# EAGLE design LightLab (EAGLE 7.6.0)
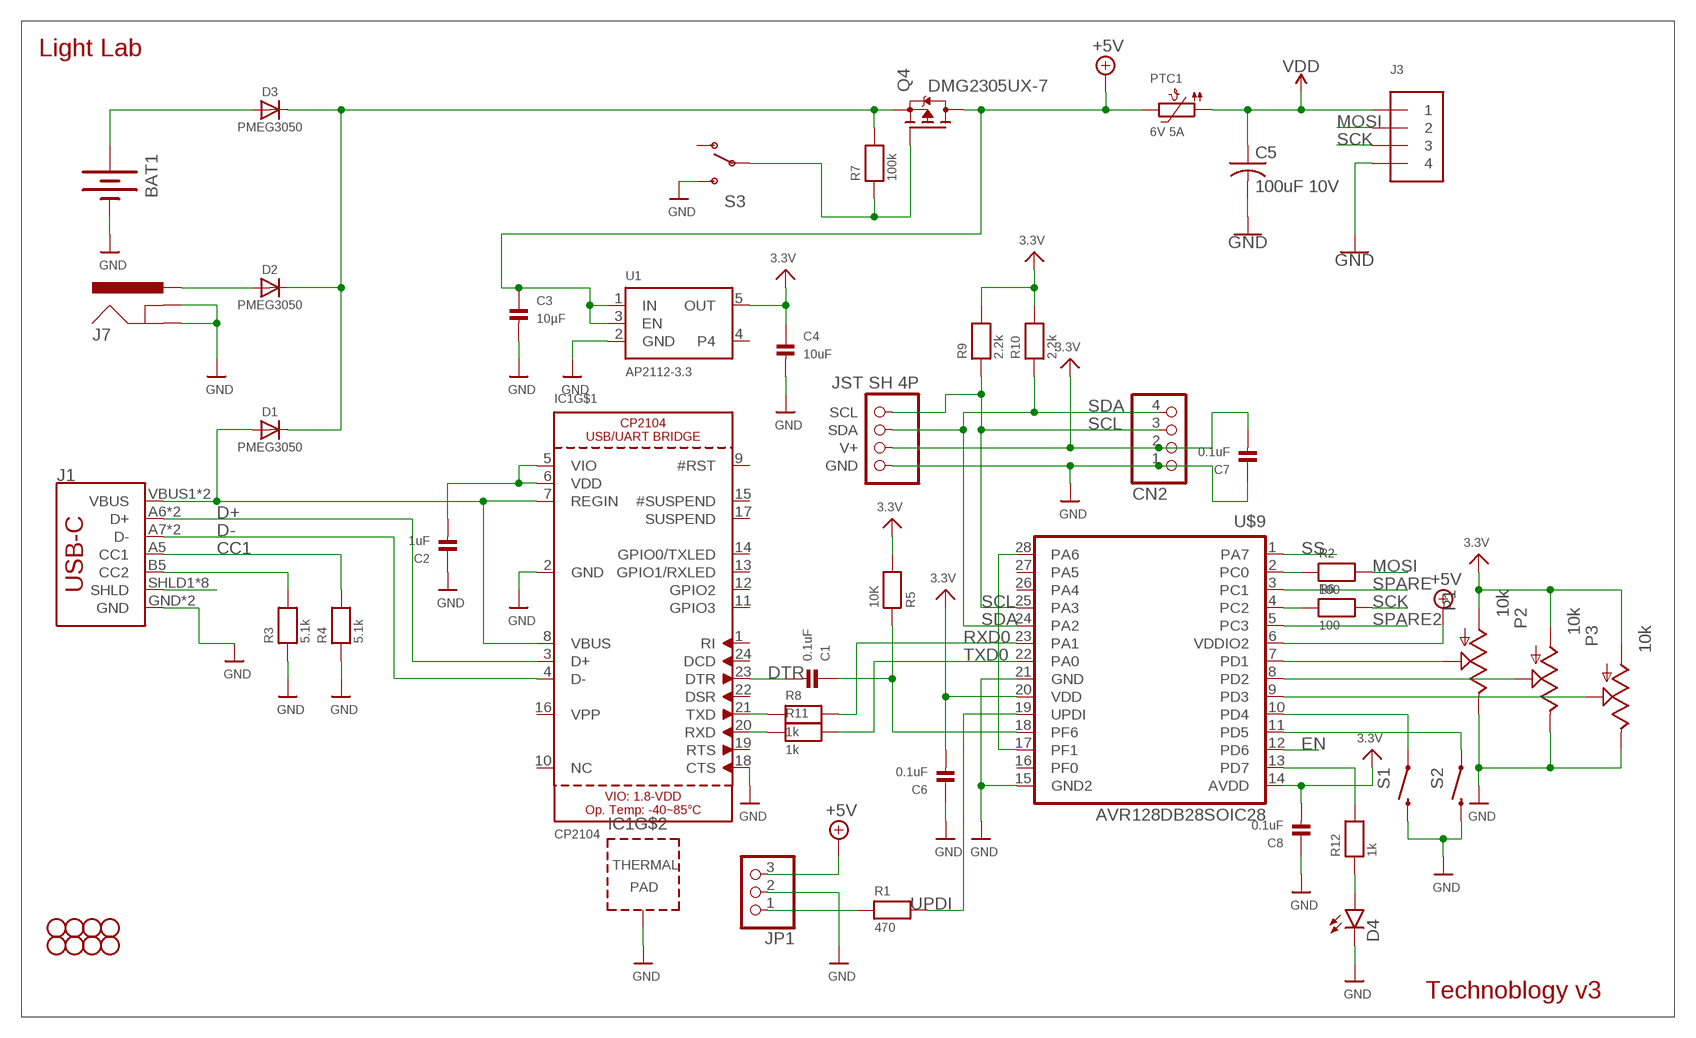
[diagram p0: schematic, sheet 1]

## Parts
BAT1  BATTERY18650  [BATTERY_18650-HOLDER]
C1  0.1uF  CAP_CERAMIC_0805MP  [_0805MP]
C2  1uF  CAP_CERAMIC_0805MP  [_0805MP]
C3  10µF  CAP_CERAMIC_0805MP  [_0805MP]
C4  10uF  CAP_CERAMIC_0805MP  [_0805MP]
C5  100uF 10V  C-USC1210  [C1210]
C6  0.1uF  CAP_CERAMIC_0805MP  [_0805MP]
C7  0.1uF  CAP_CERAMIC_0805MP  [_0805MP]
C8  0.1uF  CAP_CERAMIC_0805MP  [_0805MP]
CN2  HEADER-1X4ROUND  [1X04_ROUND]
CONN1  JST SH 4P  STEMMA_I2C_QT  [JST_SH4]
D1  PMEG3050  DIODE_SOD128  [SOD-128]
D2  PMEG3050  DIODE_SOD128  [SOD-128]
D3  PMEG3050  DIODE_SOD128  [SOD-128]
D4  LED1206-BOTTOM  [LED-1206-BOTTOM]
IC1  CP2104  [QFN24_4MM_SMSC]
J1  USB_C2-LAYER  [USB-C-16P]
J3  TERMBLOCK_1X4  [TERMBLOCK_1X3-3.5MM]
J7  5.5x2.1mm Barrel  POWER_JACKSMD  [POWER_JACK_SMD]
JP1  HEADER-1X3ROUND  [1X03_ROUND]
JP8  STAND-OFF  [STAND-OFF]
JP9  STAND-OFF  [STAND-OFF]
JP10  STAND-OFF  [STAND-OFF]
JP11  STAND-OFF  [STAND-OFF]
JP12  STAND-OFF  [STAND-OFF]
JP13  STAND-OFF  [STAND-OFF]
JP14  STAND-OFF  [STAND-OFF]
JP15  STAND-OFF  [STAND-OFF]
P1  10k  POT  [ALPS_POT]
P2  10k  POT  [ALPS_POT]
P3  10k  POT  [ALPS_POT]
PTC1  6V 5A  PTC1210  [PTC1210]
Q4  DMG2305UX-7  MOSFET-PWIDE  [SOT23-WIDE]
R1  470  RESISTOR_0805MP  [_0805MP]
R2  100  RESISTOR_0805MP  [_0805MP]
R3  5.1k  RESISTOR_0805MP  [_0805MP]
R4  5.1k  RESISTOR_0805MP  [_0805MP]
R5  10K  RESISTOR_0805MP  [_0805MP]
R6  100  RESISTOR_0805MP  [_0805MP]
R7  100k  RESISTOR_0805MP  [_0805MP]
R8  1k  RESISTOR_0805MP  [_0805MP]
R9  2.2k  RESISTOR_0805MP  [_0805MP]
R10  2.2k  RESISTOR_0805MP  [_0805MP]
R11  1k  RESISTOR_0805MP  [_0805MP]
R12  1k  RESISTOR_0805MP  [_0805MP]
S1  SWITCH-MOMENTARY-2PTH  [TACTILE-PTH]
S2  SWITCH-MOMENTARY-2PTH  [TACTILE-PTH]
S3  SWITCH-SPDTKIT  [SWITCH-SPDT_KIT]
U1  AP2112-3.3  VREG_SOT23-5  [SOT23-5]
U$9  AVR128DB28SOIC28  [SO-28W]

## Nets
3.3V: C4.1 C6.2 C7.2 C8.2 CN2.2 CONN1.2(V+) P1.P$3(A) P2.P$3(A) P3.P$3(A) R5.2 R9.2 R10.2 U1.5(OUT) U$9.14(AVDD) U$9.20(VDD)
+5V [power]: C3.1 JP1.3 PTC1.P$2 Q4.3(D) U1.1(IN) U1.3(EN) U$9.6(VDDIO2)
BAT+ [power]: BAT1.PWR@1(+) D3.A
CC1: J1.A5(CC1) R4.2
CC2: J1.B5(CC2) R3.2
D+: IC1.3(D+) J1.A6(D+) J1.B6(D+)
D-: IC1.4(D-) J1.A7(D-) J1.B7(D-)
DTR: C1.2 IC1.23(DTR)
EN: U$9.12(PD6)
GND: BAT1.GND@1(-) C2.1 C3.2 C4.2 C5.2 C6.1 C7.1 C8.1 CN2.1 CONN1.1(GND) D4.C IC1.2(GND) IC1.18(CTS) IC1.THERM(TP) J1.GND J1.GND2(GND) J3.4 J7.GND(GNDBREAK) J7.P$4(GND) JP1.2 P1.P$1(E) P2.P$1(E) P3.P$1(E) R3.1 R4.1 S1.3 S2.3 S3.3(S) U1.2(GND) U$9.15(GND2) U$9.21(GND)
MOSI: J3.2 R2.2
N$1: P1.P$2(S) U$9.7(PD1)
N$2: D4.A R12.1
N$3: R12.2 U$9.13(PD7)
N$4: IC1.20(RXD) R11.1
N$5: Q4.1(G) R7.1 S3.2(P)
N$6: P2.P$2(S) U$9.8(PD2)
N$7: C2.2 IC1.5(VIO) IC1.6(VDD)
N$8: S1.1 U$9.10(PD4)
N$9: R2.1 U$9.2(PC0)
N$10: P3.P$2(S) U$9.9(PD3)
N$11: S2.1 U$9.11(PD5)
N$12: U$9.17(PF1) U$9.28(PA6)
N$13: R6.1 U$9.4(PC2)
N$14 [power]: D1.C D2.C D3.C Q4.2(S) R7.2
N$15: IC1.21(TXD) R8.1
N$78: JP1.1 R1.1
N$79 [power]: D2.A J7.VIN0(PWR)
RESET: C1.1 R5.1 U$9.18(PF6)
RXD0: R8.2 U$9.23(PA1)
SCK: J3.3 R6.2
SCL: CN2.3 CONN1.4(SCL) R9.1 U$9.25(PA3)
SDA: CN2.4 CONN1.3(SDA) R10.1 U$9.24(PA2)
SHIELD: J1.SHLD1(SHLD) J1.SHLD2(SHLD) J1.SHLD3(SHLD) J1.SHLD4(SHLD) J1.SHLD5(SHLD) J1.SHLD6(SHLD) J1.SHLD7(SHLD) J1.SHLD8(SHLD)
SPARE: U$9.3(PC1)
SPARE2: U$9.5(PC3)
SS: U$9.1(PA7)
TXD0: R11.2 U$9.22(PA0)
UPDI: R1.2 U$9.19(UPDI)
VBUS [power]: D1.A IC1.7(REGIN) IC1.8(VBUS) J1.VBUS1(VBUS) J1.VBUS2(VBUS)
VDD [power]: C5.1 J3.1 PTC1.P$1
Unconnected: CONN1.MT1(MT) CONN1.MT2(MT) IC1.1(RI) IC1.9(#RST) IC1.10(NC) IC1.11(GPIO3) IC1.12(GPIO2) IC1.13(GPIO1/RXLED) IC1.14(GPIO0/TXLED) IC1.15(#SUSPEND) IC1.16(VPP) IC1.17(SUSPEND) IC1.19(RTS) IC1.22(DSR) IC1.24(DCD) S3.1(O) U1.4 U$9.16(PF0) U$9.26(PA4) U$9.27(PA5)

## Notes on the sheet
- Light Lab
- Technoblogy v3

## Library data of the parts
BAT1 = technoblogy:BATTERY: Battery Holders Various common sizes : AA, AAA, 18650 (PRT-12895), 20mm coin cell and 12mm coin cell. 20MM_4LEGS, BATT-10373
C1-C4 C6-C8 = microbuilder:CAP_CERAMIC: Ceramic Capacitors 0402 - 0402 Surface Mount Capacitors 16pF 50V 5% [Digikey: 445-4899-2-ND] 18pF 50V 5% [Digikey: 490-1281-2-ND] 22pF 50V 5% [Digikey: 490-1283-2-ND] 68pF 50V 5% [Digikey: 490-1289-2-ND] 0.1uF 10V 10% [Digikey: 490-1318-2-ND] 1.0uF 6.3V 10% [Digikey: 490-1320-2-ND] 0603 - 0603 Surface Mount Capacitors 16 pF 50V 5% [Digikey: 445-5051-2-ND] 22 pF 50V [Digikey: PCC220ACVTR-ND] 33 pF 50V 5% [Digikey: 490-1415-1-ND] 56pF 50V 5% [Digikey: 490-1421-1-ND] 220pF 50V 5% [Digikey: 445-1285-1-ND] 680 pF 50V 2200 pF 50V 5% C0G [Digikey: 445-1297-1-ND] 5600 pF 100V 5% X7R [Digikey: 478-3711-1-ND] 0.1 µF 25V 10% [Digikey: PCC2277TR-ND] 0.22 µF 16V 10% X7R [Digikey: 445-1318-1-ND] 1.0 µF 25V 10% [Digikey: 445-5146-2-ND] 0603 - RF Specific 3pF 250V +/-0.1pF RF [Digikey: 712-1347-1-ND] 18 pF 250V 5% [Digikey: 478-3505-1-ND or 712-1322-1-ND] 56 pF 250V 5% C0G RF [Digikey: 490-4867-1-ND] 68 pF 250V RF [Digikey: 490-4868-1-ND] 0805 - 0805 Surface Mount Capacitors 220 pF 250V 2% RF Ceramic Capacitor [Digikey: 712-1398-1-ND] 1000 pF 50V 2% NP0 Ceramic Capacitor [Digikey: 478-3760-1-ND] 0.1 µF 25V 10% Ceramic Capacitor [Digikey: PCC1828TR-ND] 1.0 µF 16V 10% Ceramic Capacitor[Digikey: 490-1691-2-ND] 10.0 µF 10V 10% Ceramic Capacitor[Digikey: 709-1228-1-ND] 10.0 uF 16V 10% Ceramic Capacitor [Digikey: 478-5165-2-ND] 47 uF 6.3V 20% Ceramic Capacitor [Digikey: 587-1779-1-ND or 399-5506-1-ND] 1206 - 1206 Surface Mount Capacitors 47uF 10V 20% Ceramic Capacitor [Digikey: 490-5528-1-ND or 399-5508-1-ND or 445-6010-1-ND] 100uF 6.3V -20%, +80% Y5V Ceramic Capacitor (Digikey: 490-4512-1-ND, Mouser: 81-GRM31CF50J107ZE1L)
C5 = adafruit:C-US: CAPACITOR, American symbol
CN2 = technoblogy:HEADER-1X4: PIN HEADER
CONN1 = adafruit_electromech:STEMMA_I2C; LCSC: C2845363
D1-D3 = microbuilder:DIODE: Diode SMA Model Volts Amps Type Vf Ir Digikey # Notes SSA34-E3 40V 3A Schottky 480mV @ 3A 200uA @ 40V SSA34-E3/61TGITR-ND CDBA120-G 20V 1A Schottky 500mV @ 1A 500uA @ 20V 641-1014-6-ND REEL MBRA210 10V 2A Schottky 350mV @ 2A 700uA @ 10V MBRA210LT3 SOD-123 Model Volts Amps Type Vf Ir Order # Notes BAT54T1G 30V 200mA Schottky 800mV @ 200mA 2uA @ 25V BAT54T1GOSTR-ND B0530W 30V 500mA Schottky 430mV @ 500mA 130uA @ 30V B0530W-FDICT-ND REEL MBR120 20V 1A Schottky 340mV @ 1A MBR120VLSFT1GOSCT-ND SOD-323 Model Volts Amps Type Vf Ir Order # Notes PMEG2005EJ 20V 500mA Schottky 355mV @ 500mA 568-4110-1-ND ZLLS410 10V 570mA Schottky 380mV @ 570mA ZLLS410CT-ND 1N4148WS 75V 150mA Silicon/Simple 1V 1N4148WSFSCT-ND REEL SOD-523 Model Volts Amps Type Vf Ir Order # Notes BAT54XV2 30V 200mA Schottky 0.8V @ 100mA BAT54XV2CT-ND TB751S 30V 30mA Schottky RB751S-40TE61CT-ND SOT23-R/W (R = Solder Paste/Reflow Ovens, W = Hand-Soldering) Model Volts Amps Type Vf Ir Order # Notes BAT54FILM 40V 300mA Schottky 497-7162-1-ND POWERDI-5 Model Volts Amps Type Vf Ir Order # Notes PDS560 60V 5A Schottky 670mV @ 5A 150uA @ 60V PDS560DICT-ND
D4 = SparkFun-LED:LED: LEDs Standard schematic elements and footprints for 5mm, 3mm, 1206, and 0603 sized LEDs. 5mm - Spark Fun Electronics SKU : COM-00529 (and others)
IC1 = microbuilder:CP2104: CP2104 - USB to UART Bridge VDD Output: 3.45V
J1 = SparkFun-Connectors:USB_C: USB Type C 16Pin Connector Super Speed pins not available on the 16-pin purely SMD connector so this part is best for USB 2.0 implementations. D1 and D2 are tied together enabling D+/- no matter which way the cable is plugged into the connector. The two channel configuration pins (CC1/2) are exposed. These are normally connected to ground via 5.1k resistors but can be reconfigured for high current/high power applications.; PROD_ID: CONN-14122
J3 = technoblogy:TERMBLOCK_1X4: 3.5mm Terminal block http://www.ladyada.net/library/pcb/eaglelibrary.html
J7 = SparkFun-Connectors:POWER_JACK: Power Jack This is the standard 5.5mm barrel jack for power. The PTH is the most common, proven, reliable, footprint. The Slot footprint only works if the mill layer is transmitted to the PCB fab house so be warned. Mating wall wart : TOL-00298 (and others); PROD_ID: CONN-08106; SF_ID: PRT-12748
JP1 = microbuilder:HEADER-1X3: PIN HEADER
JP8-JP15 = SparkFun:STAND-OFF: Stand Off This is the mechanical footprint for a #4 phillips button head screw. Use the keepout ring to avoid running the screw head into surrounding components. SKU : PRT-00447
P1-P3 = SparkFun-Electromechanical:POT; PROD_ID: RES-09177
PTC1 = microbuilder:PTC: PTC (Resettable Fuse) 1206 Package 250mA PTC (16V Max, Time-to-Trip: 0.08s) - Digikey: F2110CT-ND 1210 Package 100mA PTC (30V Max, Time-to-Trip: 0.6s) - Digikey: MF-USMF010-2CT-ND 1812 Package 750mA PTC (24V Max, Time-to-Trip: 0.2s) - Digikey: MF-MSMF075/24-2CT-ND
Q4 = microbuilder:MOSFET-P: P-Channel Mosfet LEGEND VDS: Voltage Drain-Source ID: Drain Current RDS(ON): Drain-Source On-State Resistance VGS(TH): Gate-Source Threshold Voltage CISS: Drain-Source Input Capacitance SOT-23 Name VDS ID RDS(ON) VGS(TH) CISS Order Number IRLML5103 30V 760mA 600 mOhm -- 75pF @ 25V Digikey: IRLML5103PBFCT-ND IRLML6401 12V 4.3A 50 mOhm 950mV @ 250µA 830pF @ 10V Digikey: IRLML6401PBFTR-ND NTR0202PL 20V 400mA 800 mOhm 2.3V @ 250uA 70pF @ 5V Digikey: NTR0202PLT1GOSTR-ND NTR4101PT1G 20V 1.8A 85 mOhm 1.2V @ 250uA 675pF @ 10V Digikey: NTR4101PT1GOSCT-ND DMP2004K 20V 600mA 900 mOhm 1V @ 250uA 175pF @ 16V Digikey: DMP2004KDICT-ND PMV65XP 20V 3.9A 76 mOhm 950mV @ 1mA 725pF @ 20V Digikey: 568-2358-2-ND TO-252 Name VDS ID RDS(ON) VGS(TH) CISS Order Number AOD417 30V 25A 34 mOhm 3V @ 250µA 920pF @ 15V Digikey: 785-1106-2-ND PowerPak Name VDS ID RDS(ON) VGS(TH) CISS Order Number AON7401 30V 12A 14 mOhm 3V @ 250µA 2600pF @ 15V Digikey: 785-1302-1-ND
R1-R12 = microbuilder:RESISTOR: Resistors 0402 - 0402 Surface Mount Package 22 Ohm 1% 1/16W [Digikey: 311-22.0LRTR-ND] 33 Ohm 5% 1/16W 1.0K 5% 1/16W 1.5K 5% 1/16W 2.0K 1% 1/16W 10.0K 1% 1/16W [Digikey: 311-10.0KLRTR-ND] 10.0K 5% 1/16W [Digikey: RMCF0402JT10K0TR-ND] 12.1K 1% 1/16W [Digikey: 311-22.0LRTR-ND] 100.0K 5% 1/16W 0603 - 0603 Surface Mount Package 0 Ohm 1/10 Watt 1% Resistor 15 Ohm 1/10 Watt 1% Resistor 33 Ohm 1/10 Watt 1% Resistor 49.9 Ohm 1/10 Watt 1% Resistor 100 Ohm 1/10 Watt 1% Resistor 150 Ohm 1/10 Watt 1% Resistor 240 Ohm 1/10 Watt 1% Resistor 390 Ohm 1/10 Watt 1% Resistor 560 Ohm 1/10 Watt 1% Resistor 680 Ohm 1/10 Watt 1% Resistor 750 Ohm 1/10 Watt 1% Resistor 1.0K Ohm 1/10 Watt 1% Resistor 1.5K Ohm 1/10 Watt 1% Resistor 2.0K Ohm 1/10 Watt 1% Resistor 2.2K Ohm 1/10 Watt 1% Resistor 3.3K Ohm 1/10 Watt 1% Resistor 4.7K Ohm 1/10 Watt 1% Resistor 10.0K Ohm 1/10 Watt 1% Resistor 12.0K Ohm 1/10 Watt 1% Resistor 12.1K Ohm 1/10 Watt 1% Resistor 20.0K Ohm 1/10 Watt 1% Resistor 33.0K Ohm 1/10 Watt 1% Resistor 100.0K Ohm 1/10 Watt 1% Resistor 0805 - 0805 Surface Mount Package 0 Ohm 1/8 Watt 1% Resistor 33 Ohm 1/8 Watt 1% Resistor 100 Ohm 1/8 Watt 1% Resistor 150 Ohm 1/8 Watt 1% Resistor 200 Ohm 1/8 Watt 1% Resistor 240 Ohm 1/8 Watt 1% Resistor 330 Ohm 1/8 Watt 1% Resistor 390 Ohm 1/8 Watt 1% Resistor 470 Ohm 1/8 Watt 1% Resistor 1.0K Ohm 1/8 Watt 1% Resistor 1.5K Ohm 1/8 Watt 1% Resistor 2.0K Ohm 1/8 Watt 1% Resistor 4.7K Ohm 1/8 Watt 1% Resistor 5.1K Ohm 1/8 Watt 1% Resistor 5.6K Ohm 1/8 Watt 1% Resistor 10.0K Ohm 1/8 Watt 1% Resistor 22.0K Ohm 1/8 Watt 1% Resistor 33.0K Ohm 1/8 Watt 1% Resistor 100K Ohm 1/8 Watt 1% Resistor 1206 - 1206 Surface Mount Package 2012 - 2010 Surface Mount Package 0.11 Ohm 1/2 Watt 1% Resistor - Digikey: RHM.11UCT-ND
S1 S2 = SparkFun-Electromechanical:SWITCH-MOMENTARY-2: Various NO switches- pushbuttons, reed, etc; PROD_ID: SWCH-08441
S3 = technoblogy:SWITCH-SPDT: SPDT Switch Simple slide switch, Spark Fun Electronics SKU : COM-00102 DPDT SMT slide switch, AYZ0202, SWCH-08179; PROD_ID: SWCH-08261
U1 = microbuilder:VREG_SOT23-5: SOT23-5 Fixed Voltage Regulators Part Current Out V Out V In V Dropout θJA (°C/W) TJ (°C) Digikey Part No. ADP121 150mA 3.3V 3.4-5.5V 0.09V @ 150mA -- -- ADP121-AUJZ33R7CT-ND ADP121 150mA 3.0V 3.1-5.5V 0.09V @ 150mA -- -- ADP121-AUJZ30R7CT-ND ADP122 300mA 3.3V 3.4-5.5V 0.085V @ 300mA -- -- ADP122AUJZ-3.3-R7CT-ND ADP1712 300mA 3.3V 3.5-5.5V 0.17V @ 300mA -- -- ADP1712AUJZ-3.3-R7TR-ND AP7311 (Low Cost) 150mA 3.3V 3.5-6V 0.15V @ 150mA -- -- AP7311-33WG-7DICT-ND LD39015M18R 150mA 1.8V 1.9V-5.5V 0.08V @ 100mA -- -- 497-6977-1-ND LP2985A-33DBVR 150mA 3.3V 3.3-16V 0.28V @ 150mA 206 150 296-18479-1-ND MCP1824T-3302E/OT 300mA 3.3V 3.5V-6V 0.2V @ 300mA -- -- MCP1824T-3302E/OTCT-ND MIC5205-2.5YM5 TR 150mA 2.5V 2.7-16V 0.165V @ 150mA -- -- 576-1257-2-ND MIC5205-3.0YM5 TR 150mA 3.0V 3.2V-16V 0.165V @ 150mA -- -- 576-1258-2-ND MIC5205-3.3YM5 TR 150mA 3.3V 3.5V-16V 0.165V @ 150mA -- -- 576-1259-2-ND TPS780330220 150mA 3.3V+2.2V 3.6-5.5V 250mV Max -- -- 296-23332-1-ND TDA3663/N1,135 100mA 3.3V 3.5-45V 0.18V @ 50mA -- -- 568-5343-1-ND Max operating temp can be calculated using θJA, TJ (max junction temperature), and power in watts. Set the "Maximum Ambient Temperature" until it reaches TJ ("Max Junction Temperature"), which is the absolute limit for safe use of the regulator: Heat Sink Temperature Calculator <http://www.daycounter.com/Calculators/Heat-Sink-Temperature-Calculator.phtml> For example, With 12V source into a 3.3V LP2985 and a 30mA load, we are dissipating (12V-3.3V) * 0.03A = 0.261W. With a θJA of 206 °C/W, a TJ of 150°C, and 261mW we can safely use the chip without a heat sink up to 75°C (=147.1°C Junction Temperature).
U$9 = technoblogy:AVR128DB28

## Net classes
1 power: width 1.626 mm, clearance 0.406 mm

## Board
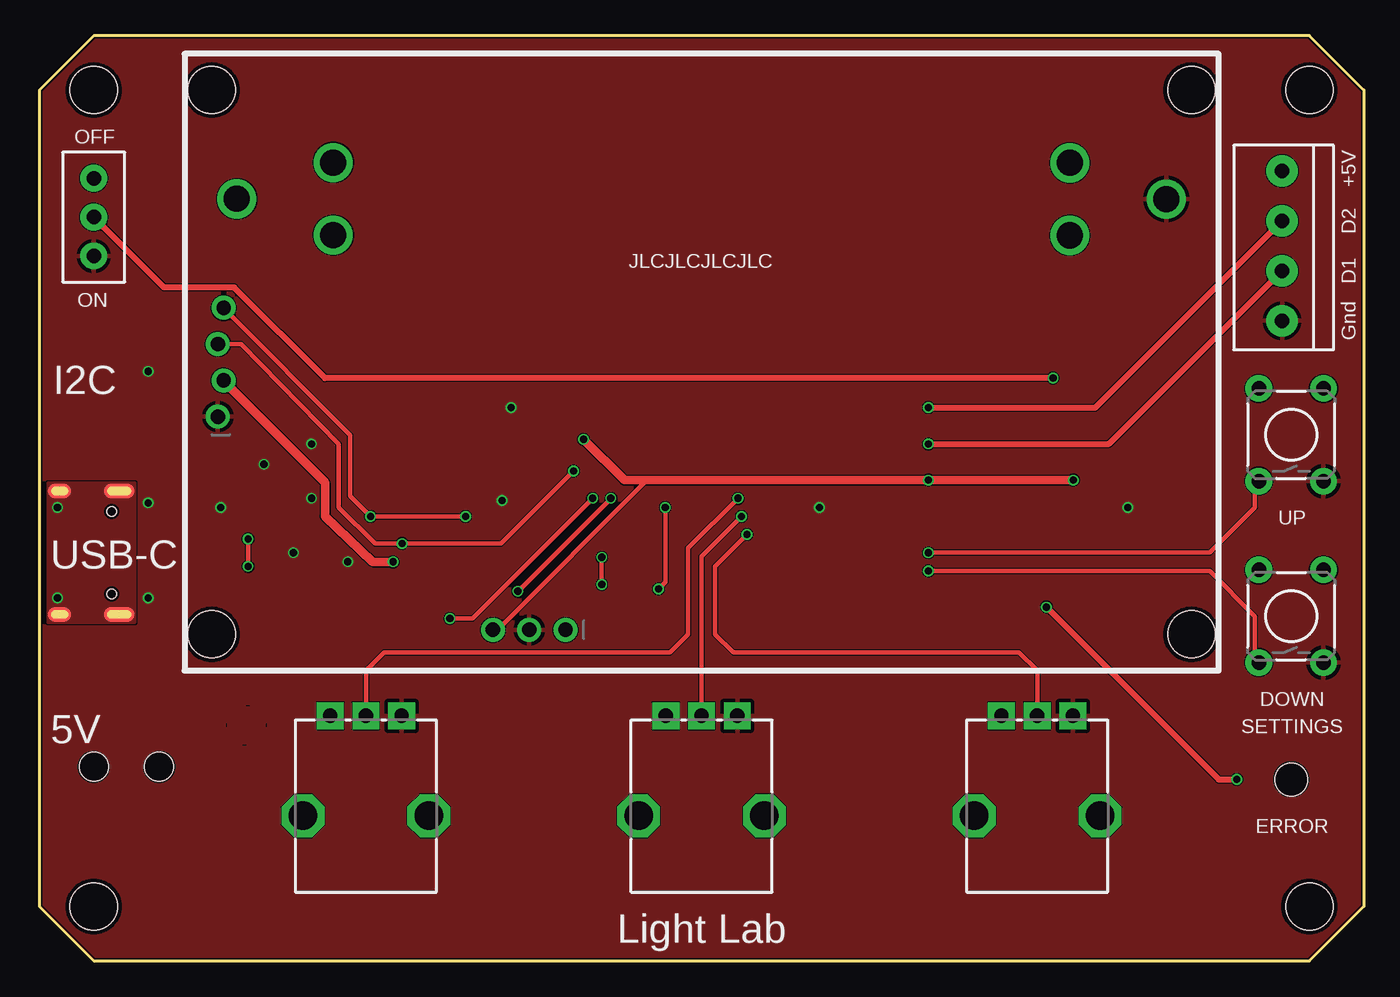
[diagram p1: board, top side]
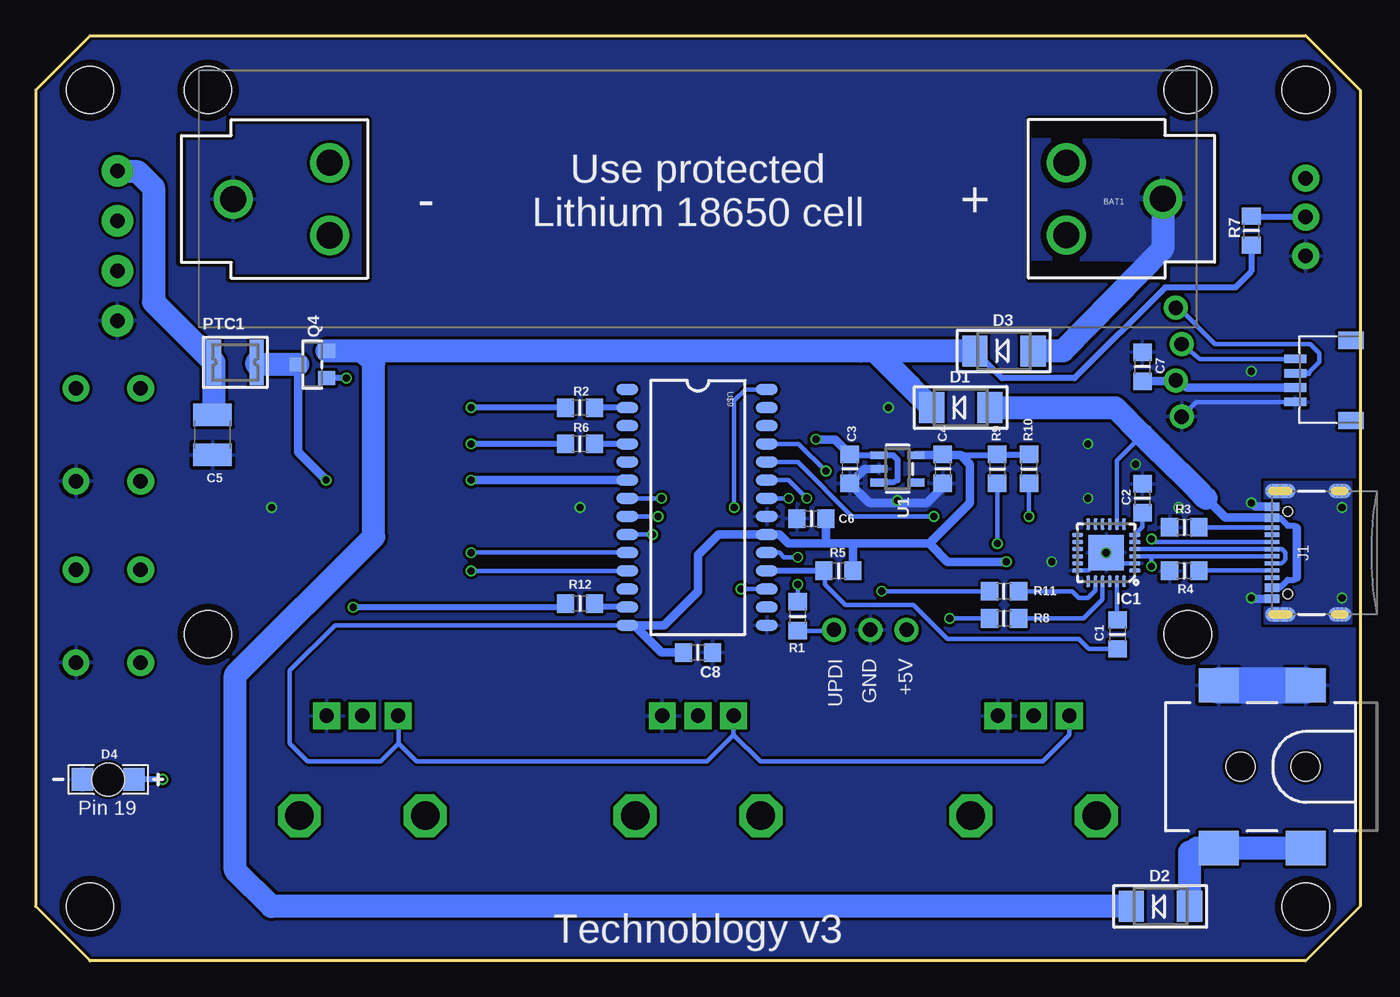
[diagram p2: board, bottom side, seen from below]

Size 92.71 x 64.77 mm. Coordinates in mm from the lower left corner, seen from the top.
Outline: 88.9,64.77 3.81,64.77 0,60.96 0,3.81 3.81,0 88.9,0 92.71,3.81 92.71,60.96 88.9,64.77
Copper layers (1*16): Top 0.035mm / dielectric 1.5mm / Bottom 0.035mm
Design rules "SparkFun-2-layer-FAB-LIMIT *": minimum track width 4mil, minimum drill 6mil, track to track 3mil, track to pad 3mil, pad to pad 3mil, via to via 3mil, smd to smd 3mil, copper to edge 4mil, drill to drill 4mil, minimum pad ring 5mil, minimum via ring 5mil, stop-mask expansion 4mil, vias tented up to drill 25mil, thermal gap 10mil
tRestrict: 4 lines

### Footprints (pad centres in the part's own frame; a part is rotated, then mirrored left to right if it is on the bottom)
BATTERY_18650-HOLDER = drill 1.829: GND@1 32.533,0.01; GND@2 25.785,2.55; GND@3 25.785,-2.53; PWR@1 -32.533,-0.01; PWR@2 -25.785,2.53; PWR@3 -25.785,-2.55
_0805MP = smd 1.2 x 1.3: 1 -1.016,0; 2 1.016,0
C1210 = smd 1.6 x 2.7: 1 -1.4,0; 2 1.4,0
1X04_ROUND = drill 1 pad 1.676: 1 -3.81,0.203; 2 -1.27,-0.203; 3 1.27,0.203; 4 3.81,-0.203
JST_SH4 = smd 0.6 x 1.55: 1 -1.5,2.006; 2 -0.5,2.006; 3 0.5,2.006; 4 1.5,2.006 | smd 1.2 x 1.8: MT1 -2.8,-1.894; MT2 2.8,-1.894
SOD-128 = smd 1.778 x 2.159: A 2.019,0; C -2.045,0
LED-1206-BOTTOM = smd 1.5 x 1.6: A -1.8,0; C 1.8,0 | hole 2.3: 0,0
QFN24_4MM_SMSC = smd 0.8 x 0.28: 1 -2,1.25; 2 -2,0.75; 3 -2,0.25; 4 -2,-0.25; 5 -2,-0.75; 6 -2,-1.25; 13 2,-1.25; 14 2,-0.75; 15 2,-0.25; 16 2,0.25; 17 2,0.75; 18 2,1.25 | smd 0.28 x 0.8: 7 -1.25,-2; 8 -0.75,-2; 9 -0.25,-2; 10 0.25,-2; 11 0.75,-2; 12 1.25,-2; 19 1.25,2; 20 0.75,2; 21 0.25,2; 22 -0.25,2; 23 -0.75,2; 24 -1.25,2 | smd 2.5 x 2.5: THERM 0,0
USB-C-16P = smd 0.3 x 1: A5 -1.25,-0.34; A6 -0.25,-0.34; A7 0.25,-0.34; A8 1.25,-0.34; B5 1.75,-0.34; B6 0.75,-0.34; B7 -0.75,-0.34; B8 -1.75,-0.34 | smd 0.6 x 1: GND -3.225,-0.34; GND2 3.225,-0.34; VBUS1 -2.45,-0.34; VBUS2 2.45,-0.34 | smd 1 x 2.1: SHLD1 -4.32,-0.915; SHLD2 4.32,-0.915 | smd 1 x 2.1 bottom: SHLD3 -4.32,-0.915; SHLD4 4.32,-0.915 | smd 1 x 1.6: SHLD5 -4.32,-5.095; SHLD8 4.32,-5.095 | smd 1 x 1.6 bottom: SHLD6 -4.32,-5.095; SHLD7 4.32,-5.095 | hole 0.65: -2.89,-1.445; 2.89,-1.445
TERMBLOCK_1X3-3.5MM = drill 1 pad 2.184: 1 7.05,0; 2 3.55,0; 3 0.05,0; 4 -3.45,0
POWER_JACK_SMD = smd 2.8 x 2.4: GND 0,-5.7; P$4 6.1,-5.7; VIN0 0,5.7; VIN1 6.1,5.7 | hole 2.032: 0,0; 4.572,0
1X03_ROUND = drill 1 pad 1.676: 1 -2.54,0; 2 0,0; 3 2.54,0
STAND-OFF = hole 3.302: 0,0
ALPS_POT = drill 1 pad 1.88 square: P$1 7,-2.5; P$2 7,0; P$3 7,2.5 | drill 2 octagon: P$4 0,-4.4; P$5 0,4.4
PTC1210 = smd 1 x 3.2: P$1 -1.5,0; P$2 1.5,0
SOT23-WIDE = smd 1 x 1.2: 1 -0.95,-1; 2 0.95,-1; 3 0,1
TACTILE-PTH = drill 1.016 pad 1.88: 1 -3.251,2.261; 2 3.251,2.261; 3 -3.251,-2.261; 4 3.251,-2.261
SWITCH-SPDT_KIT = drill 1.016 pad 1.88: 1 0,2.718; 2 0,0; 3 0,-2.718
SOT23-5 = smd 0.55 x 1.2: 1 -0.95,-1.3; 2 0,-1.3; 3 0.95,-1.3; 4 0.95,1.3; 5 -0.95,1.3
SO-28W = smd 0.762 x 1.524: 1 -8.255,-4.953; 2 -6.985,-4.953; 3 -5.715,-4.953; 4 -4.445,-4.953; 5 -3.175,-4.953; 6 -1.905,-4.953; 7 -0.635,-4.953; 8 0.635,-4.953; 9 1.905,-4.953; 10 3.175,-4.953; 11 4.445,-4.953; 12 5.715,-4.953; 13 6.985,-4.953; 14 8.255,-4.953; 15 8.255,4.826; 16 6.985,4.826; 17 5.715,4.826; 18 4.445,4.826; 19 3.175,4.826; 20 1.905,4.826; 21 0.635,4.826; 22 -0.635,4.826; 23 -1.905,4.826; 24 -3.175,4.826; 25 -4.445,4.826; 26 -5.715,4.826; 27 -6.985,4.826; 28 -8.255,4.826

### Placement (x,y rotation side)
BAT1  46.35,53.34 180 bottom
C1  16.99,22.86 90 bottom
C2  15.24,32.38 270 bottom
C3  35.72,34.45 270 bottom
C4  29.21,34.45 270 bottom
C5  80.33,36.83 270 bottom
C6  38.42,30.96 0 bottom
C7  15.24,41.59 270 bottom
C8  46.35,21.59 180 bottom
CN2  12.7,41.91 90 top
CONN1  2.54,40.64 90 bottom
D1  27.94,38.73 0 bottom
D2  13.97,3.81 0 bottom
D3  24.92,42.7 0 bottom
D4  87.63,12.7 180 bottom
IC1  17.78,28.57 180 bottom
J1  6.51,28.57 90 bottom
J3  87,48.26 90 top
J7  3.81,13.59 180 bottom
JP1  34.29,23.18 180 top
JP8  80.64,60.96 0 top
JP9  12.06,60.96 0 top
JP10  80.64,22.86 0 top
JP11  88.9,60.96 0 top
JP12  12.06,22.86 0 top
JP13  3.81,60.96 0 top
JP14  88.9,3.81 0 top
JP15  3.81,3.81 0 top
P1  22.86,10.16 90 top
P2  46.35,10.16 90 top
P3  69.85,10.16 90 top
PTC1  78.74,41.91 0 bottom
Q4  73.34,41.75 90 bottom
R1  39.37,24.13 90 bottom
R2  54.61,38.73 180 bottom
R3  12.32,30.35 0 bottom
R4  12.32,27.3 0 bottom
R5  36.51,27.3 0 bottom
R6  54.61,36.2 180 bottom
R7  7.62,51.12 270 bottom
R8  24.92,23.97 180 bottom
R9  25.4,34.45 90 bottom
R10  23.18,34.45 90 bottom
R11  24.92,25.88 180 bottom
R12  54.61,25.02 0 bottom
S1  87.63,36.83 90 top
S2  87.63,24.13 90 top
S3  3.81,52.07 0 top
U1  32.38,34.45 270 bottom
U$9  46.35,31.75 270 bottom

### Tracks (layer width: path | path; a pad name or v marks a point on that pad's centre or on a via)
3.3V  (via drill 0.5)
  Top 0.61: CN2.2 12.9,40.6 20,33.5 20,31.11 23.34,27.94 v24.77,27.94
  Bottom 0.305: P1.P$3 20.36,15.84 22.23,13.97 41.99,13.97 43.85,15.84 | P2.P$3 43.85,15.84 | 43.85,15.84 45.72,13.97 66.04,13.97 67.31,15.24 | 67.31,15.24 67.31,15.85 P3.P$3 | U$9.14 71.75,23.5 74.93,20.32 74.93,15.24 73.66,13.97 68.58,13.97 67.31,15.24 | U1.5 29.28,35.4 C4.1
  Bottom 0.406: U$9.20 43.02,29.84 | 27.94,35.4 25.47,35.4 R9.2 R10.2
  Bottom 0.61: CONN1.2 12.13,40.14 CN2.2 12.97,40.58 C7.2 | U$9.14 50.8,23.5 | 50.8,23.5 48.74,23.5 46.35,25.88 46.35,28.42 44.93,29.84 U$9.20 40.64,29.84 40.01,29.21 37.47,29.21 | U1.5 27.94,35.4 27.3,34.76 27.3,32.07 30.16,29.21 | 37.47,29.21 35.56,29.21 | 35.56,29.21 30.16,29.21 | C6.2 37.4,29.27 37.47,29.21 | R5.2 35.5,29.15 35.56,29.21 | v24.77,27.94 28.89,27.94 30.16,29.21 | C8.2 48.9,21.59 50.8,23.5
+5V  (via drill 0.5)
  Top 0.305: JP1.3 32.07,23.18 42.55,33.66
  Top 0.61: v72.39,33.66 v62.23,33.66 42.55,33.66 40.96,33.66 v38.1,36.51
  Bottom 0.305: 35.65,35.4 C3.1
  Bottom 0.406: 35.65,35.4 U1.1 32.7,35.4 32.38,35.08 32.38,33.66 32.7,33.5 U1.3
  Bottom 0.61: Q4.3 74.34,35.61 v72.39,33.66 | v38.1,36.51 36.77,36.51 C3.1 | U$9.6 v62.23,33.66
  Bottom 1.626: Q4.3 77.24,41.75 PTC1.P$2
BAT+
  Bottom 1.626: BAT1.PWR@1 13.82,49.84 20.8,42.7 D3.A
  pour Bottom: 23.18,57.47 10.48,57.31 10.48,49.05 23.18,49.21
CC1
  Bottom 0.305: 11.3,27.32 R4.2 11.28,27.32 J1.A5
CC2
  Bottom 0.305: 11.3,30.32 R3.2 11.28,30.32 J1.B5
D+  (via drill 0.5)
  Top 0.305: v14.61,29.53 v14.61,27.62
  Bottom 0.305: 14.61,28.32 15.24,28.32 IC1.3 | v14.61,27.62 14.61,28.32 | J1.B6 14.4,29.32 v14.61,29.53 | J1.A6 14.61,28.32
D-
  Bottom 0.305: IC1.4 J1.A7 5.49,28.82 5.24,28.57 5.24,28.1 5.4,27.94 5.51,27.82 J1.B7
DTR
  Bottom 0.305: IC1.23 17.03,23.99 C1.2
GND  (via drill 0.5)
  Bottom 0.305: 15.76,27.82 IC1.2 17.03,27.82 IC1.THERM 19.03,27.32 IC1.18 | C4.2 29.21,33.18 | CONN1.1 11.46,39.14 CN2.1
  Bottom 0.61: U1.2 34.7,34.45 C3.2 34.35,32.07 30.32,32.07 29.21,33.18 | J1.GND 7.57,25.35 v7.62,25.4 | J1.GND2 7.35,31.8 v7.62,32.07
  Bottom 2.54: J7.GND J7.P$4
  other vias: 12.7,31.75 15.72,34.77 17.78,28.57 19.05,32.38 33.02,38.73 19.05,36.2 54.61,31.75 76.2,31.75 7.62,41.27 32.38,32.23 21.59,27.94
  pour Bottom (isolate 0.203, rank 2): -2.54,64.77 95.25,64.77 95.25,0 -2.54,0
  pour Top (rank 2): -3.81,64.77 -3.81,0 96.52,0 96.52,64.77
MOSI  (via drill 0.5)
  Top 0.406: v62.23,38.73 73.92,38.73 J3.2
  Bottom 0.406: R2.2 v62.23,38.73
N$1  (via drill 0.5)
  Top 0.305: v48.9,32.38 45.4,28.89 45.4,22.86 44.13,21.59 24.13,21.59 22.86,20.32 P1.P$2
  Bottom 0.305: U$9.7 v48.9,32.38
N$2  (via drill 0.5)
  Top 0.406: v83.82,12.7 82.55,12.7 v70.48,24.77
  Bottom 0.406: v83.82,12.7 D4.A | v70.48,24.77 55.88,24.77 R12.1
N$3
  Bottom 0.406: U$9.13 53.34,24.77 R12.2
N$4
  Bottom 0.305: IC1.20 18.53,25.92 19.05,25.4 19.68,25.4 20.16,25.88 R11.1
N$5  (via drill 0.5)
  Top 0.406: v70.96,40.8 20,40.8 13.65,47.15 8.73,47.15 S3.2
  Bottom 0.406: S3.2 7.56,52.07 R7.1 | v70.96,40.8 Q4.1
N$6  (via drill 0.5)
  Top 0.305: P2.P$2 46.35,28.32 v49.15,31.11
  Bottom 0.305: U$9.8 v49.15,31.11
N$7
  Bottom 0.305: C2.2 15.24,30.36 IC1.6 IC1.5
N$8  (via drill 0.5)
  Top 0.305: v62.23,28.57 81.92,28.57 85.09,31.75 85.09,33.3 S1.1
  Bottom 0.305: U$9.10 v62.23,28.57
N$9
  Bottom 0.406: U$9.2 R2.1
N$10  (via drill 0.5)
  Top 0.305: v49.53,29.84 47.31,27.62 47.31,22.86 48.58,21.59 68.58,21.59 69.85,20.32 P3.P$2
  Bottom 0.305: U$9.9 v49.53,29.84
N$11  (via drill 0.5)
  Top 0.305: v62.23,27.3 81.92,27.3 85.09,24.13 85.09,21.16 S2.1
  Bottom 0.305: U$9.11 v62.23,27.3
N$12  (via drill 0.5)
  Top 0.305: v43.34,26.04 43.81,26.51 v43.81,31.75
  Bottom 0.305: v43.34,26.04 U$9.17 | U$9.28 43.02,40.01 43.81,39.21 v43.81,31.75
N$13
  Bottom 0.406: U$9.4 R6.1
N$14
  Bottom 0.406: 33.66,42.07 33.97,42.7 | 34.95,42.1 35.56,42.7 | 31.11,40.64 31.5,40.25 | R7.2 7.62,48.26 8.73,47.15 13.65,47.15 20,40.8 25.06,40.8 D3.C
  Bottom 1.626: 33.97,42.7 35.56,42.7 | D1.C 31.5,40.25 33.97,42.7 | 33.97,42.7 D3.C 69.85,42.7 | D2.C 76.2,3.81 78.74,6.35 78.74,20 69.06,29.69 69.06,41.91 69.85,42.7 | 69.85,42.7 Q4.2
N$15
  Bottom 0.305: IC1.21 18.03,25.31 19.37,23.97 R8.1
N$78
  Bottom 0.305: R1.1 36.89,23.11 JP1.1
N$79
  Bottom 1.626: J7.VIN0 11.43,7.89 11.43,7.62 11.95,7.62 D2.A
RESET
  Bottom 0.305: R5.1 37.47,27.24 37.47,26.35 36.04,24.92 31.27,24.92 28.89,22.54 19.68,22.54 18.99,21.84 C1.1
  Bottom 0.406: R5.1 U$9.18
RXD0  (via drill 0.5)
  Top 0.305: v38.73,32.38 30.32,23.97 v28.73,23.97
  Bottom 0.305: U$9.23 40.01,33.66 v38.73,32.38 | R8.2 v28.73,23.97
SCK  (via drill 0.5)
  Top 0.406: v62.23,36.2 74.88,36.2 J3.3
  Bottom 0.406: R6.2 v62.23,36.2
SCL  (via drill 0.5)
  Top 0.305: CN2.3 14.13,43.18 20.95,36.2 20.95,31.75 23.5,29.21 v25.4,29.21 32.32,29.21 v37.4,34.29
  Bottom 0.305: R9.1 v25.4,29.21 | CONN1.4 11.23,42.14 CN2.3 | U$9.25 39.31,36.2 v37.4,34.29
SDA  (via drill 0.5)
  Top 0.305: v29.84,31.11 v23.18,31.11 21.75,32.54 21.75,36.83 12.86,45.72 CN2.4
  Bottom 0.305: R10.1 v23.18,31.11 | 3.63,41.14 2.86,41.91 2.86,42.55 3.49,43.18 10.16,43.18 12.7,45.72 | U$9.24 39.37,34.92 35.56,31.11 v29.84,31.11
  Bottom 0.406: CONN1.3 3.63,41.14 | CN2.4 12.7,45.72
SHIELD  (via drill 0.5)
  other vias: 1.27,31.75 1.27,25.4
  pour Top (isolate 0.203, no thermals): 0.64,33.5 6.67,33.5 6.67,23.65 0.64,23.65
  pour Bottom (isolate 0.203, no thermals): 0.64,33.5 6.67,33.5 6.67,23.65 0.64,23.65
TXD0  (via drill 0.5)
  Top 0.305: v33.5,25.88 v40.01,32.38
  Bottom 0.305: v40.01,32.38 U$9.22 | R11.2 v33.5,25.88
UPDI  (via drill 0.5)
  Top 0.305: v39.37,26.35 v39.37,28.26
  Bottom 0.305: R1.2 v39.37,26.35 | v39.37,28.26 40.32,28.26 40.64,28.57 U$9.19
VBUS
  Bottom 0.305: 10.19,31.75 10.17,31.74 | 15.24,35.88 15.24,35.91 14.88,36.27 14.68,36.27 13.97,35.56 | IC1.7 IC1.8 17.03,35.04 15.24,36.83
  Bottom 0.406: J1.VBUS2 5.62,31.02 5.08,30.48 4.6,30.48 4.45,30.32 | J1.VBUS1 5.62,26.12 5.08,26.67 4.6,26.67 4.45,26.83
  Bottom 0.61: 10.17,31.74 10.17,31.76 | 10.17,31.76 11.43,33.02 | 4.45,30.32 4.45,26.83 | J1.VBUS2 9.44,31.02 10.17,31.76
  Bottom 1.626: D1.A 17.14,38.73 15.24,36.83 13.97,35.56 11.43,33.02 10.79,32.38
VDD
  Bottom 1.626: C5.1 80.24,38.32 PTC1.P$1 84.45,46.12 84.45,54.13 85.57,55.24 86.93,55.24 J3.1

### Text on the board
tPlace: OFF | +5V | D2 | JLCJLCJLCJLC | D1 | ON | Gnd | I2C | UP | USB-C | DOWN | SETTINGS | 5V | ERROR | Light Lab
bPlace: Use protected / Lithium 18650 cell | +5V | GND | UPDI | Pin 19 | Technoblogy v3